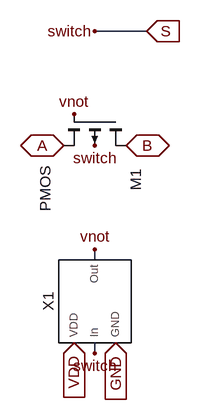
[diagram p0: schematic gate_pmos.asc]
gate_pmos.asc, the LTspice schematic file:
Version 4
SHEET 1 936 680
WIRE 464 -240 384 -240
WIRE 384 112 384 96
WIRE 384 256 384 240
FLAG 384 96 vnot
FLAG 384 -240 switch
FLAG 352 -112 vnot
FLAG 336 -64 A
IOPIN 336 -64 BiDir
FLAG 432 -64 B
IOPIN 432 -64 BiDir
FLAG 464 -240 S
IOPIN 464 -240 In
FLAG 384 -64 switch
FLAG 384 256 switch
FLAG 352 240 VDD
IOPIN 352 240 In
FLAG 416 240 GND
IOPIN 416 240 In
SYMBOL NOT 384 176 R270
SYMATTR InstName X1
SYMBOL pmos4 432 -112 R90
WINDOW 0 84 -15 Left 2
WINDOW 3 80 124 Left 2
SYMATTR InstName M1

The netlist it stands for:
* gate_pmos.asc
XX1 GND S VDD vnot NOT  ; pins GND In VDD Out
M1 B vnot A S PMOS
.model NMOS NMOS
.model PMOS PMOS
.lib standard.mos
.backanno
.end